# Altium project LM-008.PrjPcb
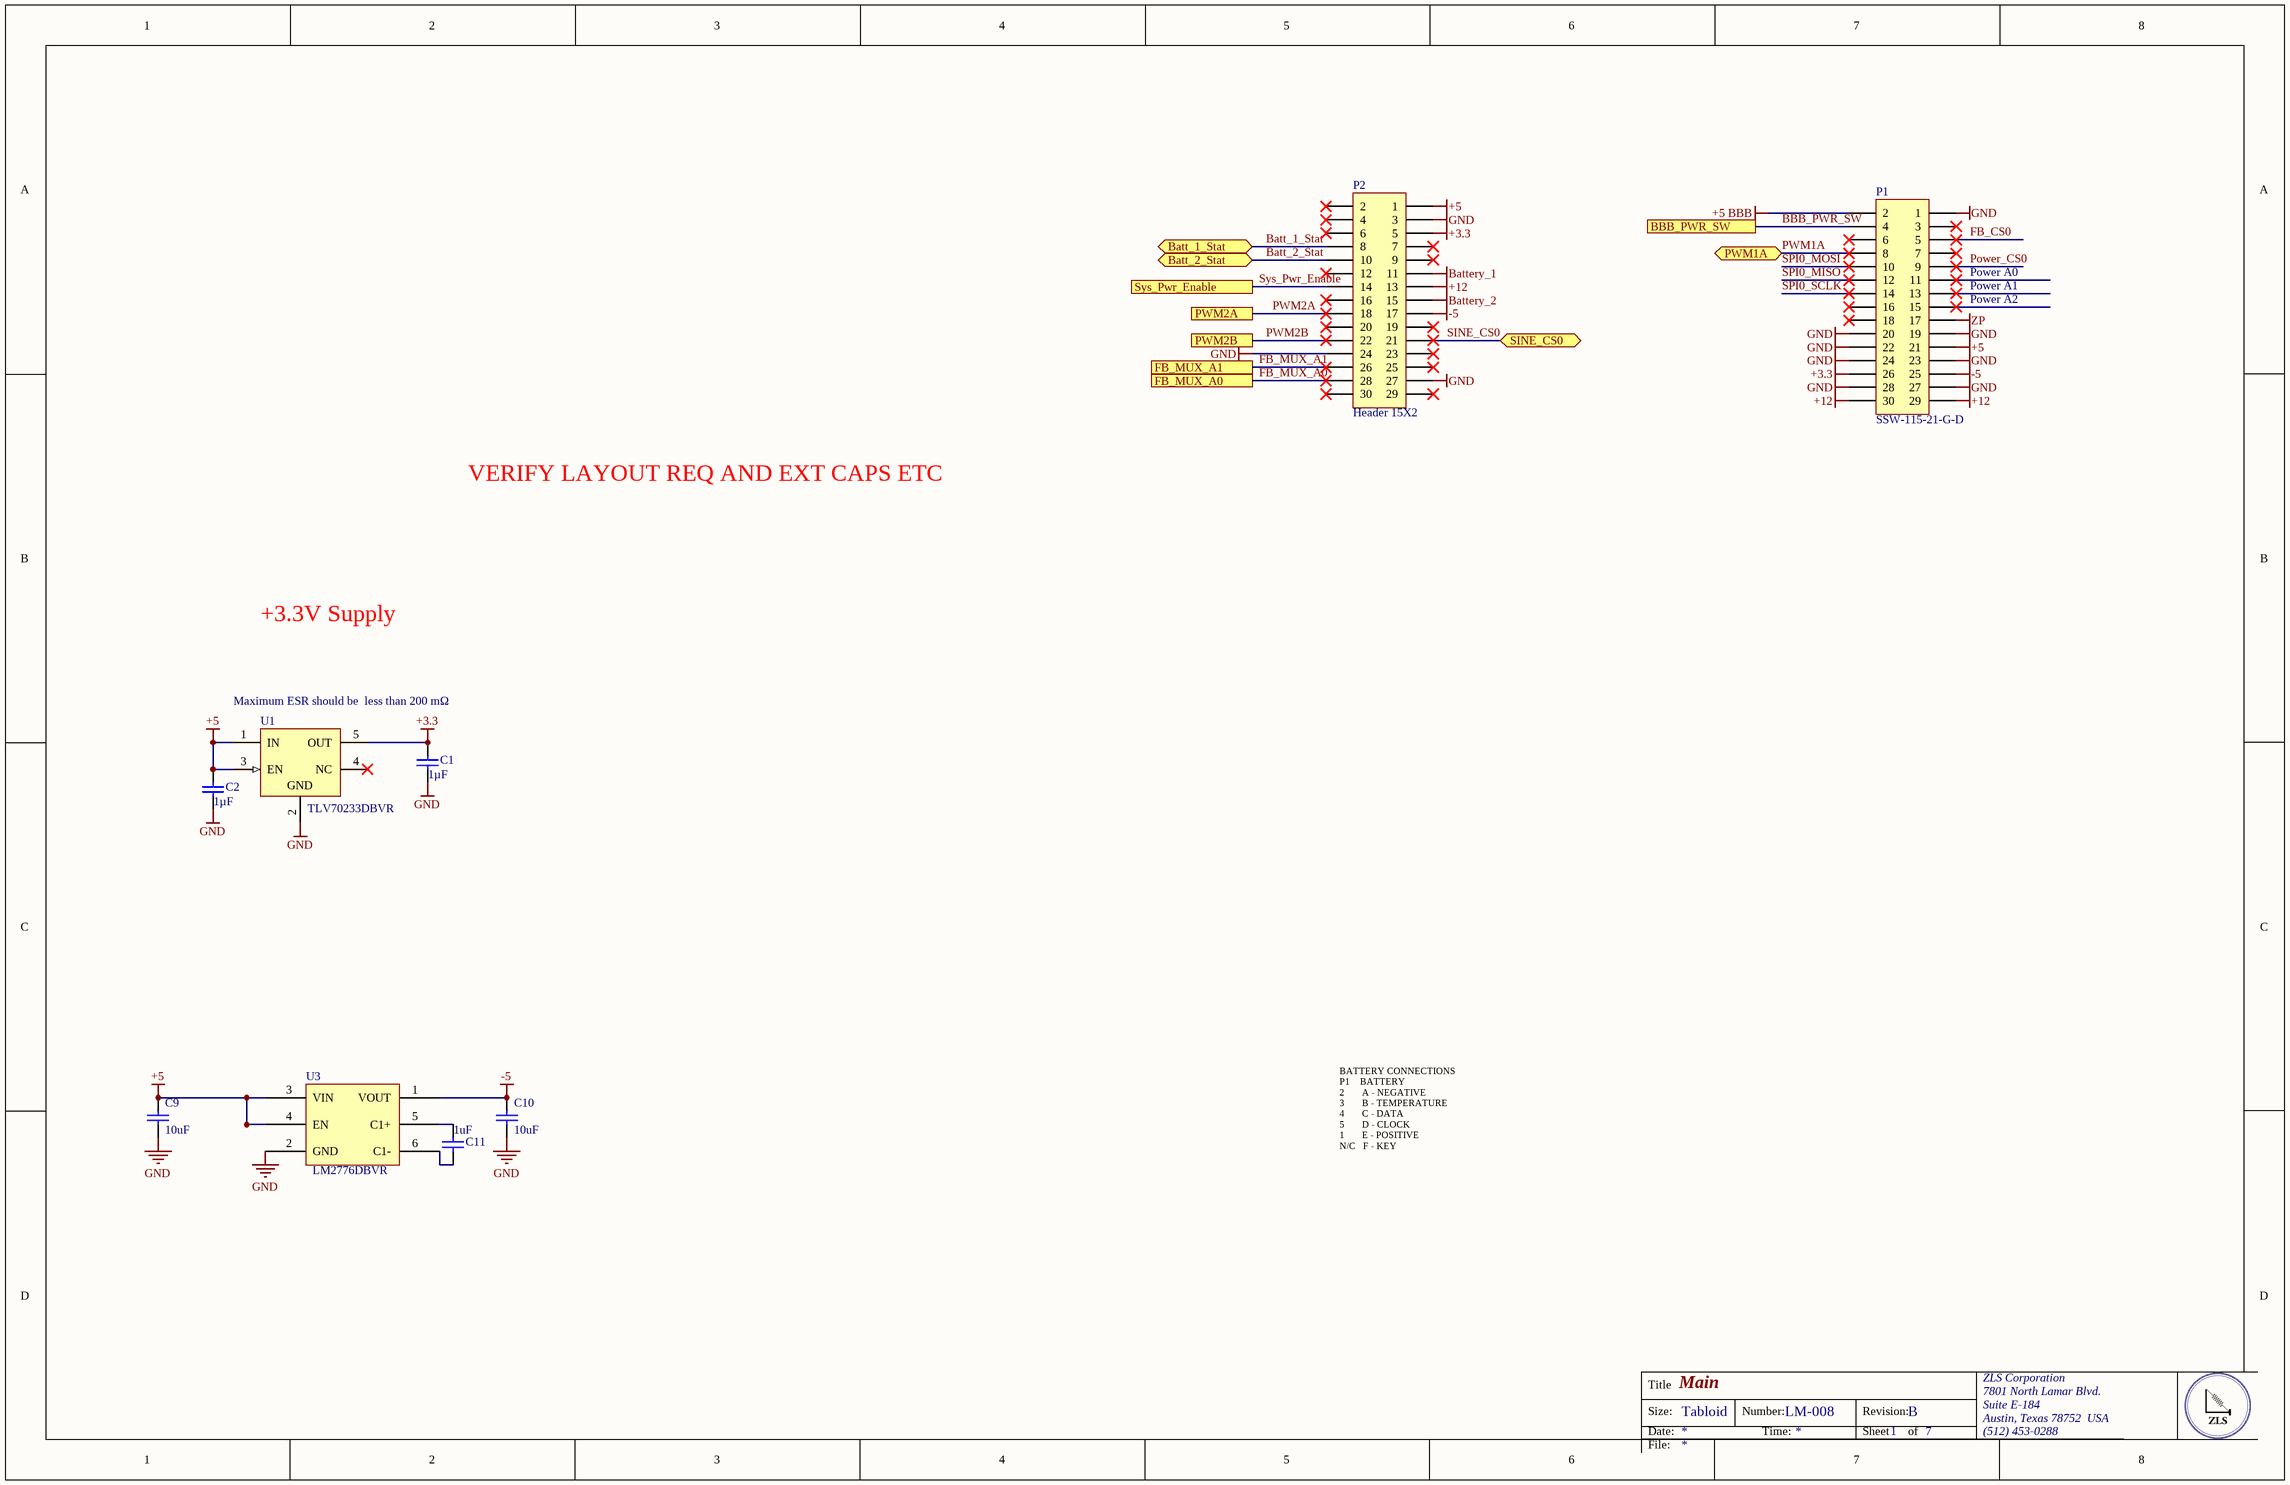
[diagram p0: LM-008.SchDoc]
5 sheets, 53 parts. Net scope: flat (ports and power ports of the same name join across sheets).
Board file: LM-008.PcbDoc
Sheets:
  LM-008.SchDoc
  12_Supply.SchDoc
  Force_Plate_Power_Supply.SchDoc
  BBB-Supply.SchDoc
  36V_HV_Supply.SchDoc

## Sheet LM-008.SchDoc: Main
size Tabloid; DocumentNumber: LM-008; Revision: B; SheetNumber: 1; SheetTotal: 7; DocumentName: LM-008

### Parts
C1  Capacitance: 1µF  [CAPC1206(3216)130_N]  (hidden comment: CAP CER 1UF 50V X7R 1210)
C2  Capacitance: 1µF  [CAPC1206(3216)130_N]  (hidden comment: CAP CER 1UF 50V X7R 1210)
C9  10uF  [CAPC0805(2012)145_N]
C10  10uF  [CAPC0805(2012)145_N]
C11  1uF  [CAPC0805(2012)145_N]
P1  SSW-115-21-G-D  [HDR2X15]
P2  Header 15X2  [HDR2X15]
U1  TLV70233DBVR  [DBV0005A_N]
U3  LM2776DBVR  [LM2776DBVR]

### Ports
Batt_1_Stat, Batt_2_Stat, BBB_PWR_SW, FB_MUX_A0, FB_MUX_A1, PWM1A, PWM2A, PWM2B, SINE_CS0, Sys_Pwr_Enable

### Nets
+3.3: C1.2 P1.26 P2.5 U1.5(OUT)
+5: C2.2 C9.1 P1.21 P2.1 U1.1(IN) U1.3(EN) U3.3(VIN) U3.4(EN)
+5 BBB: P1.2
+12: P1.29 P1.30 P2.13
-5: C10.1 P1.25 P2.17 U3.1(VOUT)
Battery_1: P2.11
Battery_2: P2.15
GND: C1.1 C2.1 C9.2 C10.2 P1.1 P1.19 P1.20 P1.22 P1.23 P1.24 P1.27 P1.28 P2.3 P2.24 P2.27 U1.2(GND) U3.2(GND)
ZP: P1.17
Batt_1_Stat: P2.8 ; port Batt_1_Stat
Batt_2_Stat: P2.10 ; port Batt_2_Stat
BBB_PWR_SW: P1.4 ; port BBB_PWR_SW
FB_CS0: P1.5
FB_MUX_A0: P2.28 ; port FB_MUX_A0
FB_MUX_A1: P2.26 ; port FB_MUX_A1
Power_CS0: P1.9
PWM1A: P1.8 ; port PWM1A
PWM2A: P2.18 ; port PWM2A
PWM2B: P2.22 ; port PWM2B
SINE_CS0: P2.21 ; port SINE_CS0
SPI0_MISO: P1.12
SPI0_MOSI: P1.10
SPI0_SCLK: P1.14
Sys_Pwr_Enable: P2.14 ; port Sys_Pwr_Enable
NetC11_1: C11.1 U3.5(C1+)
NetC11_2: C11.2 U3.6(C1-)

Not connected (* = marked no-connect by the designer): P1 3* 6* 7* 11* 13* 15* 16* 18*; P2 2* 4* 6* 7* 9* 12* 16* 19* 20* 23* 25* 29* 30*; U1 4(NC)*

### Notes on the sheet
- (near P1) Power A0
- (near P1) Power A1
- (near P1) Power A2
- VERIFY LAYOUT REQ AND EXT CAPS ETC
- +3.3V Supply
- Maximum ESR should be  less than 200 mΩ
- BATTERY CONNECTIONS
  P1    BATTERY
  2       A - NEGATIVE
  3       B - TEMPERATURE
  4       C - DATA
  5       D - CLOCK
  1       E - POSITIVE
  N/C   F - KEY
- Title
- Size:
- Date:
- Tabloid
- Number:
- Time:
- Revision:
- Sheet
- of
- ZLS Corporation
- 7801 North Lamar Blvd.
- Suite E-184
- Austin, Texas 78752  USA
- (512) 453-0288
- File:

### Library data of the parts
C1 C2 = CMP-1037-04913-1: Manufacturer: Murata Electronics North America; Manufacturer Part Number: GRM32RR71H105KA01L; Tolerance: ±10%; Supplier 1: Digi-Key; Supplier Part Number 1: 490-1863-6-ND; RoHS: RoHS Compliant; Category: Capacitors; Stock 1: 66890; Pricing 1: 1=0.35, 10=0.242, 100=0.1449, 500=0.10868 (USD); Packaging: Digi-Reel®; Part Status: Active; Voltage - Rated: 50V; Temperature Coefficient: X7R; Operating Temperature: -55°C ~ 125°C; Features: -; Ratings: -; Applications: General Purpose; Mounting Type: Surface Mount, MLCC; Package / Case: 1210 (3225 Metric); Size / Dimension: 0.126" L x 0.098" W (3.20mm x 2.50mm); Height - Seated (Max): -; Thickness (Max): 0.079" (2.00mm); Lead Spacing: -; Lead Style: -; ComponentLink1URL: http://search.murata.co.jp/Ceramy/image/img/A01X/G101/ENG/GRM32RR71H105KA01-01.pdf; ComponentLink1Description: http://search.murata.co.jp/Ceramy/image/img/A01X/G101/ENG/GRM32RR71H105KA01-01.pdf
C9 C10 = CMP-1036-04795-1: CAP CER 10UF 16V X6S 0805; Manufacturer: TDK Corporation; Manufacturer Part Number: C2012X6S1C106K085AC; Tolerance: ±10%; Notification: Current market demand for these product types have resulted in fluctuating and extending lead times. Lead times may differ.; Supplier 1: Digi-Key; Supplier Part Number 1: 445-14483-6-ND; RoHS: RoHS Compliant; Category: Capacitors; Stock 1: 0; Pricing 1: 1=0.38, 10=0.259, 100=0.1466, 500=0.1035, 1000=0.09056 (USD); Packaging: Digi-Reel®; Part Status: Active; Voltage - Rated: 16V; Temperature Coefficient: X6S; Operating Temperature: -55°C ~ 105°C; Features: Low ESL; Ratings: -; Applications: General Purpose; Failure Rate: -; Mounting Type: Surface Mount, MLCC; Package / Case: 0805 (2012 Metric); Size / Dimension: 0.079" L x 0.049" W (2.00mm x 1.25mm); Height - Seated (Max): -; Thickness (Max): 0.039" (1.00mm); Lead Spacing: -; Lead Style: -; ComponentLink1URL: https://product.tdk.com/info/en/catalog/datasheets/mlcc_commercial_general_en.pdf; ComponentLink1Description: https://product.tdk.com/info/en/catalog/datasheets/mlcc_commercial_general_en.pdf
C11 = CMP-1036-04795-1: CAP CER 1UF 25V X7R 0805; Manufacturer: Yageo; Manufacturer Part Number: CC0805KKX7R6BB105; Tolerance: ±10%; Voltage - Rated: 10V; Notification: Current market demand for these product types have resulted in fluctuating and extending lead times. Lead times may differ.; Supplier 1: Digi-Key; Supplier Part Number 1: 311-1458-6-ND; RoHS: RoHS Compliant; Category: Capacitors; Stock 1: 30000; Pricing 1: 1=0.25, 10=0.168, 100=0.0852, 500=0.0583, 1000=0.05158 (USD); Packaging: Digi-Reel®; Part Status: Active; Temperature Coefficient: X7R; Operating Temperature: -55°C ~ 125°C; Features: -; Ratings: -; Applications: General Purpose; Failure Rate: -; Mounting Type: Surface Mount, MLCC; Package / Case: 0805 (2012 Metric); Size / Dimension: 0.079" L x 0.049" W (2.00mm x 1.25mm); Height - Seated (Max): -; Thickness (Max): 0.057" (1.45mm); Lead Spacing: -; Lead Style: -; ComponentLink1URL: http://www.yageo.com/documents/recent/UPY-GPHC_X7R_6.3V-to-50V_18.pdf; ComponentLink1Description: http://www.yageo.com/documents/recent/UPY-GPHC_X7R_6.3V-to-50V_18.pdf
P1 = Header 15X2: Header, 15-Pin, Dual row; Manufacturer: Samtec Inc.; Connector Type: Receptacle; Style: Board to Board or Cable; Number of Positions: 30; Number of Positions Loaded: All; Pitch - Mating: 0.100" (2.54mm); Contact Length - Post: 0.104" (2.64mm); Material Flammability Rating: UL94 V-0; Current Rating: 5.7A per Contact; Supplier 1: Digi-Key; Supplier Part Number 1: SSW-115-21-G-D-ND; Manufacturer Part Number: SSW-115-21-G-D; RoHS: RoHS Compliant; Category: Connectors, Interconnects; Stock 1: 0; Pricing 1: 1=4.78 (USD); Packaging: Bulk; Part Status: Active; Contact Type: Forked; Row Spacing - Mating: 0.100" (2.54mm); Mounting Type: Through Hole; Termination: Solder; Fastening Type: Push-Pull; Contact Finish - Mating: Gold; Contact Finish Thickness - Mating: 20.0µin (0.51µm); Insulation Color: Black; Insulation Height: 0.335" (8.51mm); Operating Temperature: -55°C ~ 125°C; Contact Finish - Post: Gold; Mated Stacking Heights: -; Ingress Protection: -; Features: -; Voltage Rating: -; Applications: -; Insulation Material: Liquid Crystal Polymer (LCP); Contact Shape: Square; Contact Material: Phosphor Bronze; Contact Finish Thickness - Post: 3.00µin (0.076µm)
P2 = Header 15X2: Header, 15-Pin, Dual row; LatestRevisionDate: 17-Jul-2002; LatestRevisionNote: Re-released for DXP Platform.; Publisher: Altium Limited
U1 = CMP-0394-00528-2: Single Output LDO, 300 mA, Fixed 3.3 V Output, 2 to 5.5 V Input, with Low IQ, 5-pin SOT-23 (DBV), -40 to 125 degC, Green (RoHS & no Sb/Br); Manufacturer: Texas Instruments; Vout Adj(Max)(V): 3.3; Vin(Max)(V): 5.5; SubFamily: Single Channel LDO; Iq(Typ)(mA): 0.03; Iout(Max)(A): 0.3; Vin(Min)(V): 2; Vdo(Typ)(mV): 220; Vout Adj(Min)(V): 3.3; Eco-Plan: Green (RoHS & no Sb/Br); PackageVersion: 4073253-4/K; ComponentLink1Description: Manufacturer URL; DatasheetVersion: SLVSAG6B; ComponentLink2Description: Datasheet; ComponentLink3URL: http://www.ti.com/litv/pdf/mpds018i; ComponentLink2URL: http://www.ti.com/general/docs/lit/getliterature.tsp?genericPartNumber=TLV70233&fileType=pdf; PackageReference: DBV0005A; ComponentLink1URL: http://www.ti.com/; Mounting Technology: Surface Mount; ComponentLink3Description: Package Specification; PackageDescription: 5-Pin Plastic Small Outline, Body 1.60 Ãƒâ€” 2.90 mm, Pitch 0.95 mm; Code_JEDEC: MO-178; Fixed Output Options(V): 3.3; PartNumber: TLV70233DBVR; Accuracy(%): 2
U3 = LM2776DBVR: IC REG SWTCHD CAP INV 6SOT23; Manufacturer: Texas Instruments; Function: Ratiometric; Output Configuration: Negative; Topology: Charge Pump; Output Type: Fixed; Number of Outputs: 1; Voltage - Input (Min): 2.7V; Voltage - Input (Max): 5.5V; Voltage - Output (Min/Fixed): -Vin; Current - Output: 200mA; Frequency - Switching: 2MHz; Synchronous Rectifier: No; Supplier 1: Digi-Key; Supplier Part Number 1: 296-43957-6-ND; Manufacturer Part Number: LM2776DBVR; RoHS: RoHS Compliant; Category: Integrated Circuits (ICs); Stock 1: 13045; Pricing 1: 1=1.05, 10=0.936, 100=0.7297, 500=0.60276, 1000=0.47586 (USD); Packaging: Digi-Reel®; Part Status: Active; Voltage - Output (Max): -; Operating Temperature: -40°C ~ 85°C (TA); Mounting Type: Surface Mount; Package / Case: SOT-23-6; Supplier Device Package: SOT-23-6; ComponentLink1URL: http://www.ti.com/lit/ds/symlink/lm2776.pdf; ComponentLink1Description: http://www.ti.com/lit/ds/symlink/lm2776.pdf

## Sheet 12_Supply.SchDoc: 12V Supply
size Tabloid; DocumentNumber: LM-008; Revision: B; SheetNumber: 4; SheetTotal: 7
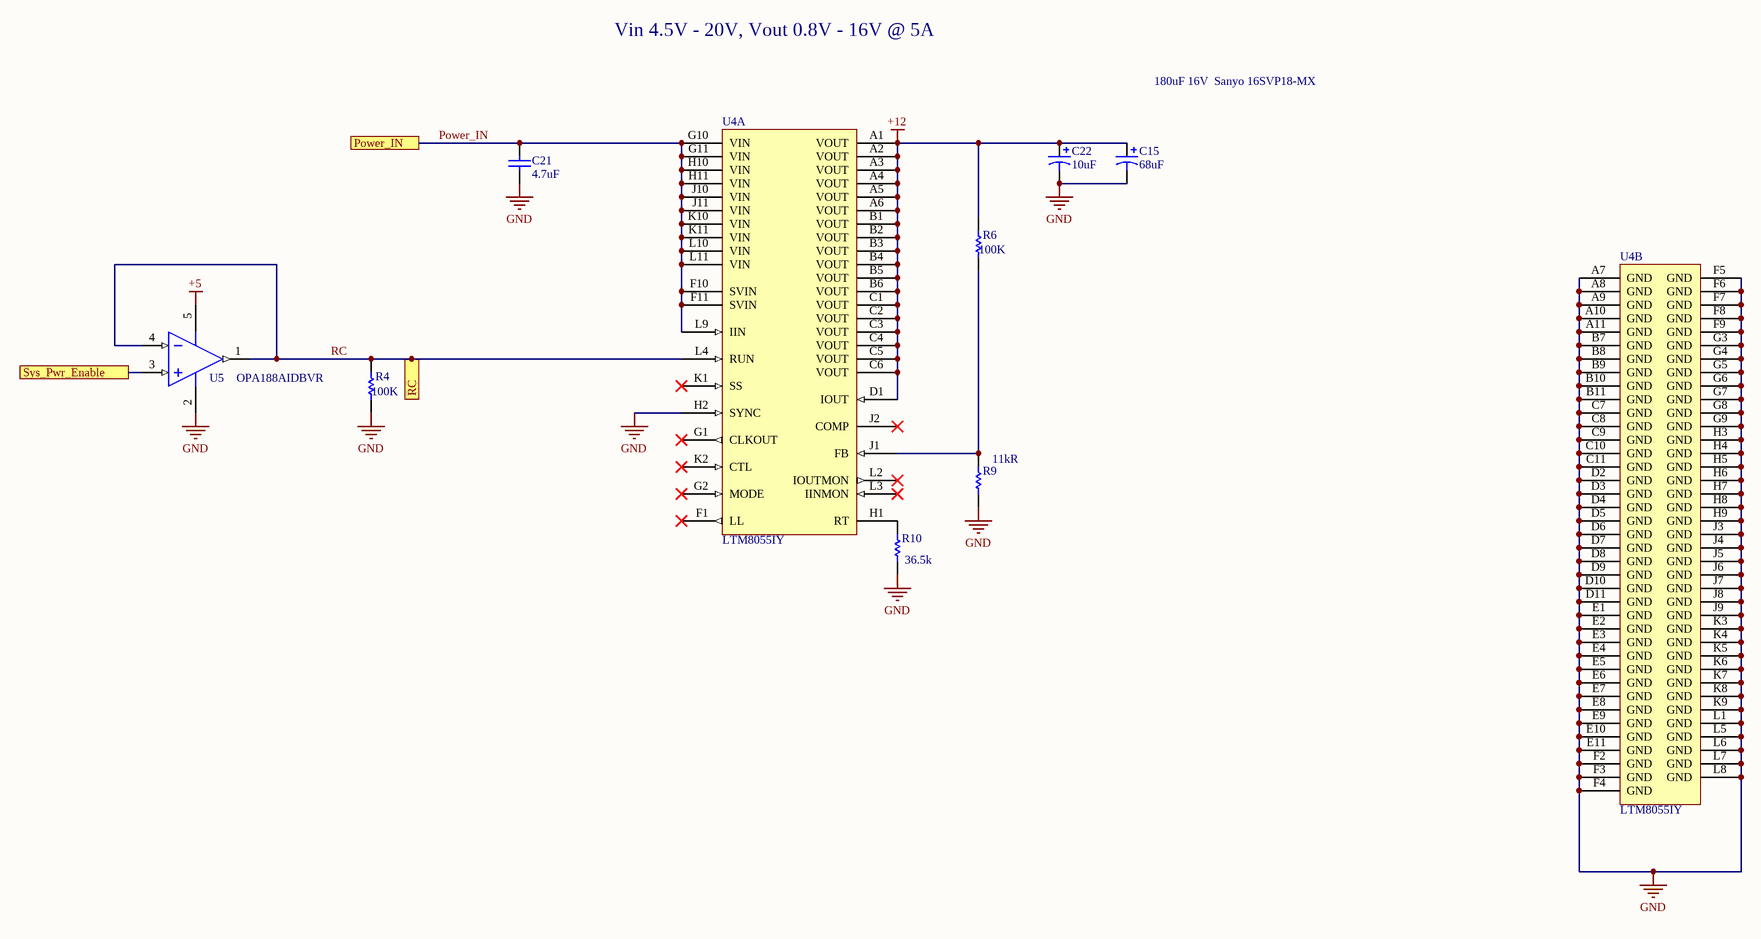
[diagram p1: 12_Supply.SchDoc]

### Parts
C15  68uF  [AVX-CAPC7343_V]
C21  4.7uF  [CAPC1210(3225)100_M]
C22  10uF  [C0805]
R4  Resistance: 100K  [RESC0805(2012)_M]  (hidden comment: RES SMD 100K OHM 1% 1/8W 0805)
R6  Resistance: 100K  [RESC0805(2012)_M]  (hidden comment: RES SMD 100K OHM 1% 1/8W 0805)
R9  Resistance: 11kR  [RESC0805(2012)_M]  (hidden comment: RES SMD 11K OHM 1% 1/8W 0805)
R10  Resistance: 36.5k  [RESC0805(2012)_M]  (hidden comment: RES SMD 35K OHM 1% 1/8W 0805)
U4  LTM8055IY  [LT-BGA-121-15000X15000X4920]  (parts A,B of 2)
U5  OPA188AIDBVR  [DBV0005A_M]

### Ports
Power_IN, RC, Sys_Pwr_Enable

### Nets
+5: U5.5(V+)
+12: C15.1 C22.1 R6.1 U4.A1(VOUT) U4.A2(VOUT) U4.A3(VOUT) U4.A4(VOUT) U4.A5(VOUT) U4.A6(VOUT) U4.B1(VOUT) U4.B2(VOUT) U4.B3(VOUT) U4.B4(VOUT) U4.B5(VOUT) U4.B6(VOUT) U4.C1(VOUT) U4.C2(VOUT) U4.C3(VOUT) U4.C4(VOUT) U4.C5(VOUT) U4.C6(VOUT) U4.D1(IOUT)
GND: C15.2 C21.1 C22.2 R4.2 R9.2 R10.2 U4.A7(GND) U4.A8(GND) U4.A9(GND) U4.A10(GND) U4.A11(GND) U4.B7(GND) U4.B8(GND) U4.B9(GND) U4.B10(GND) U4.B11(GND) U4.C7(GND) U4.C8(GND) U4.C9(GND) U4.C10(GND) U4.C11(GND) U4.D2(GND) U4.D3(GND) U4.D4(GND) U4.D5(GND) U4.D6(GND) U4.D7(GND) U4.D8(GND) U4.D9(GND) U4.D10(GND) U4.D11(GND) U4.E1(GND) U4.E2(GND) U4.E3(GND) U4.E4(GND) U4.E5(GND) U4.E6(GND) U4.E7(GND) U4.E8(GND) U4.E9(GND) U4.E10(GND) U4.E11(GND) U4.F2(GND) U4.F3(GND) U4.F4(GND) U4.F5(GND) U4.F6(GND) U4.F7(GND) U4.F8(GND) U4.F9(GND) U4.G3(GND) U4.G4(GND) U4.G5(GND) U4.G6(GND) U4.G7(GND) U4.G8(GND) U4.G9(GND) U4.H2(SYNC) U4.H3(GND) U4.H4(GND) U4.H5(GND) U4.H6(GND) U4.H7(GND) U4.H8(GND) U4.H9(GND) U4.J3(GND) U4.J4(GND) U4.J5(GND) U4.J6(GND) U4.J7(GND) U4.J8(GND) U4.J9(GND) U4.K3(GND) U4.K4(GND) U4.K5(GND) U4.K6(GND) U4.K7(GND) U4.K8(GND) U4.K9(GND) U4.L1(GND) U4.L5(GND) U4.L6(GND) U4.L7(GND) U4.L8(GND) U5.2(V-)
Power_IN: C21.2 U4.F10(SVIN) U4.F11(SVIN) U4.G10(VIN) U4.G11(VIN) U4.H10(VIN) U4.H11(VIN) U4.J10(VIN) U4.J11(VIN) U4.K10(VIN) U4.K11(VIN) U4.L9(IIN) U4.L10(VIN) U4.L11(VIN) ; port Power_IN
RC: R4.1 U4.L4(RUN) U5.1(OUT) U5.4(IN-) ; port RC
Sys_Pwr_Enable: U5.3(IN+) ; port Sys_Pwr_Enable
NetR6_2: R6.2 R9.1 U4.J1(FB)
NetR10_1: R10.1 U4.H1(RT)

Not connected (* = marked no-connect by the designer): U4 F1(LL)* G1(CLKOUT)* G2(MODE)* J2(COMP)* K1(SS)* K2(CTL)* L2(IOUTMON)* L3(IINMON)*

### Notes on the sheet
- Vin 4.5V - 20V, Vout 0.8V - 16V @ 5A
- 180uF 16V  Sanyo 16SVP18-MX
- Title
- Size:
- Date:
- Tabloid
- Number:
- Time:
- Revision:
- Sheet
- of
- ZLS Corporation
- 7801 North Lamar Blvd.
- Suite E-184
- Austin, Texas 78752  USA
- (512) 453-0288
- File:

### Library data of the parts
C15 = CMP-0279-00002-2: CAP TANT POLY 68UF 25V 2917; Manufacturer: Kyocera AVX; Manufacturer Part Number: TCJE686M025R0050; Tolerance: 20%; ESR (Equivalent Series Resistance): 50mR; Leakage Current: 170uA; Life (Hours): 2000Hour; Dissipation Factor: 6%; ComponentLink2Description: Datasheet; ComponentLink2URL: http://www.avx.com/docs/Catalogs/taj.pdf; ComponentLink1URL: http://www.avx.com/; ComponentLink1Description: Manufacturer URL; Supplier 1: Digi-Key; Supplier Part Number 1: 478-9471-6-ND; Stock 1: 439; Pricing 1: 1=3.92, 10=3.163, 100=2.4672 (USD); Mount: Surface Mount; Case/Package: 2917; Case Code (Imperial): 2917; Case Code (Metric): 7343; Min Operating Temperature: -55°C; Max Operating Temperature: 105°C; Capacitance: 68uF; Voltage Rating: 25V; Packaging: Tape and Reel; Package Quantity: 400; Voltage Rating (DC): 25V; Termination: SMD/SMT; Features: General Purpose; Length: 7.3mm; Height: 4.3mm; Width: 0.169inch; Height - Seated (Max): 0.169inch; Depth: 4.3mm; Radiation Hardening: No; ComponentLink3URL: http://www.avx.com/docs/catalogs/tcj.pdf?src-supplier=Avnet; ComponentLink3Description: http://www.avx.com/docs/catalogs/tcj.pdf?src-supplier=Avnet
C21 = CMP-1038-00619-1: CAP CER 4.7UF 50V X7R 1210; Manufacturer: Murata; Manufacturer Part Number: GCM32ER71H475KA55K; Tolerance: 10%; Supplier 1: Digi-Key; Supplier Part Number 1: 490-8066-6-ND; Stock 1: 63504; Pricing 1: 1=1.8, 10=1.424, 100=1.0676, 500=0.80666, 1000=0.71177 (USD); Mount: Surface Mount; Case/Package: 1210; Case Code (Metric): 3225; Case Code (Imperial): 1210; Min Operating Temperature: -55°C; Max Operating Temperature: 125°C; Capacitance: 4.7uF; Packaging: Tape and Reel; Package Quantity: 1; Voltage Rating: 50V; Voltage Rating (DC): 50V; Dielectric: X7R; Termination: SMD/SMT; Length: 3.2mm; Height: 2.5mm; Width: 0.098inch; Thickness: 0.106inch; Depth: 2.5mm; Ratings: AEC-Q200; Radiation Hardening: No; ComponentLink1URL: http://search.murata.co.jp/Ceramy/image/img/A01X/partnumbering_e_02.pdf?src-supplier=Digi-Key; ComponentLink1Description: http://search.murata.co.jp/Ceramy/image/img/A01X/partnumbering_e_02.pdf?src-supplier=Digi-Key; ComponentLink2URL: http://psearch.en.murata.com/capacitor/product/GCM32ER71H475KA55%23.pdf?src-supplier=Digi-Key; ComponentLink2Description: http://psearch.en.murata.com/capacitor/product/GCM32ER71H475KA55%23.pdf?src-supplier=Digi-Key; ComponentLink3URL: http://psearch.murata.com/capacitor/product/GCM32ER71H475KA55%23.pdf?src-supplier=Avnet; ComponentLink3Description: http://psearch.murata.com/capacitor/product/GCM32ER71H475KA55%23.pdf?src-supplier=Avnet
C22 = Cap Pol3: Polarized Capacitor (Surface Mount)
R4 R6 = CMP-1013-00017-1: Manufacturer: Vishay; Manufacturer Part Number: CRCW0805100KFKEA; Temperature Coefficient: 100ppm/°C; Power Rating: 125mW; Voltage Rating: 150V; Supplier 1: Avnet; Supplier Part Number 1: CRCW0805100KFKEA/BKN; Stock 1: 1317; Pricing 1: 1=0.1, 10=0.049, 25=0.042, 50=0.035, 100=0.028 (USD); Mount: Surface Mount; Case/Package: 0805; Number of Pins: 2; Weight: 0.000194oz; Contact Plating: Tin; Case Code (Imperial): 0805; Case Code (Metric): 2012; Min Operating Temperature: -55°C; Max Operating Temperature: 155°C; Tolerance: 1%; Composition: Thick Film; Termination: SMD/SMT; Packaging: Tape and Reel; Package Quantity: 5000; Military Standard: Not; Voltage Rating (DC): 150V; Length: 2mm; Height: 0.45mm; Width: 1.25mm; Depth: 1.25mm; Radiation Hardening: No; Lead Free: Lead Free; REACH SVHC: Unknown; ComponentLink1URL: https://datasheet.ciiva.com/11809/0900766b80d98b26-11809057.pdf; ComponentLink1Description: https://datasheet.ciiva.com/11809/0900766b80d98b26-11809057.pdf; ComponentLink2URL: https://datasheet.ciiva.com/7777/1697337-7777349.pdf; ComponentLink2Description: https://datasheet.ciiva.com/7777/1697337-7777349.pdf; ComponentLink3URL: https://datasheet.ciiva.com/3258/dcrcwe3-3258006.pdf; ComponentLink3Description: https://datasheet.ciiva.com/3258/dcrcwe3-3258006.pdf; ComponentLink4URL: https://datasheet.ciiva.com/16754/70201119-16754822.pdf; ComponentLink4Description: https://datasheet.ciiva.com/16754/70201119-16754822.pdf; ComponentLink5URL: https://datasheet.ciiva.com/8337/dcrcwe3-8337738.pdf; ComponentLink5Description: https://datasheet.ciiva.com/8337/dcrcwe3-8337738.pdf; ComponentLink6URL: https://datasheet.ciiva.com/16341/dcrcwe3-16341530.pdf; ComponentLink6Description: https://datasheet.ciiva.com/16341/dcrcwe3-16341530.pdf; ComponentLink7URL: https://datasheet.ciiva.com/16852/dcrcwe3-16852810.pdf; ComponentLink7Description: https://datasheet.ciiva.com/16852/dcrcwe3-16852810.pdf; ComponentLink8URL: https://datasheet.ciiva.com/16720/70201119-16720891.pdf; ComponentLink8Description: https://datasheet.ciiva.com/16720/70201119-16720891.pdf; ComponentLink9URL: https://datasheet.ciiva.com/7777/1720486-7777565.pdf; ComponentLink9Description: https://datasheet.ciiva.com/7777/1720486-7777565.pdf
R9 = CMP-1013-00017-1: Manufacturer: TE Connectivity Holsworthy; Manufacturer Part Number: CRG0805F11K; Temperature Coefficient: 100ppm/°C; Power Rating: 125mW; Voltage Rating: 150V; Number of Resistors: 1; ComponentLink1URL: https://datasheet.ciiva.com/11809/0900766b80d98b26-11809057.pdf; ComponentLink1Description: https://datasheet.ciiva.com/11809/0900766b80d98b26-11809057.pdf; ComponentLink2URL: https://datasheet.ciiva.com/7777/1697337-7777349.pdf; ComponentLink2Description: https://datasheet.ciiva.com/7777/1697337-7777349.pdf; ComponentLink3URL: https://datasheet.ciiva.com/3258/dcrcwe3-3258006.pdf; ComponentLink3Description: https://datasheet.ciiva.com/3258/dcrcwe3-3258006.pdf; ComponentLink4URL: https://datasheet.ciiva.com/16754/70201119-16754822.pdf; ComponentLink4Description: https://datasheet.ciiva.com/16754/70201119-16754822.pdf; ComponentLink5URL: https://datasheet.ciiva.com/8337/dcrcwe3-8337738.pdf; ComponentLink5Description: https://datasheet.ciiva.com/8337/dcrcwe3-8337738.pdf; ComponentLink6URL: https://datasheet.ciiva.com/16341/dcrcwe3-16341530.pdf; ComponentLink6Description: https://datasheet.ciiva.com/16341/dcrcwe3-16341530.pdf; ComponentLink7URL: https://datasheet.ciiva.com/16852/dcrcwe3-16852810.pdf; ComponentLink7Description: https://datasheet.ciiva.com/16852/dcrcwe3-16852810.pdf; ComponentLink8URL: https://datasheet.ciiva.com/16720/70201119-16720891.pdf; ComponentLink8Description: https://datasheet.ciiva.com/16720/70201119-16720891.pdf; ComponentLink9URL: https://datasheet.ciiva.com/7777/1720486-7777565.pdf; ComponentLink9Description: https://datasheet.ciiva.com/7777/1720486-7777565.pdf; Supplier 1: Digikey; Supplier Part Number 1: A126334DKR-ND; Stock 1: 142510; Pricing 1: 1=0.1, 10=0.052, 100=0.021, 1000=0.00943, 2500=0.00819 (USD); Mount: Surface Mount; Case/Package: 0805; Weight: 0.000194oz; Case Code (Imperial): 0805; Case Code (Metric): 2012; Min Operating Temperature: -55°C; Max Operating Temperature: 125°C; Tolerance: 1%; Packaging: Tape and Reel; Composition: Thick Film; Package Quantity: 5000; Number of Terminations: 2; Termination: Solder; Length: 2mm; Height: 0.55mm; Width: 1.25mm; ELV: Compliant; ComponentLink10URL: http://www.mouser.com/ds/2/418/NG_CD_1623104_BA-655654.pdf?src-supplier=Mouser; ComponentLink10Description: http://www.mouser.com/ds/2/418/NG_CD_1623104_BA-655654.pdf?src-supplier=Mouser
R10 = CMP-1013-00017-1: Manufacturer: Vishay; Manufacturer Part Number: CRCW080536K5FKEA; Temperature Coefficient: 100ppm/°C; Max Power Dissipation: 125mW; Voltage Rating: 150V; ComponentLink1URL: https://datasheet.ciiva.com/11809/0900766b80d98b26-11809057.pdf; ComponentLink1Description: https://datasheet.ciiva.com/11809/0900766b80d98b26-11809057.pdf; ComponentLink2URL: https://datasheet.ciiva.com/7777/1697337-7777349.pdf; ComponentLink2Description: https://datasheet.ciiva.com/7777/1697337-7777349.pdf; ComponentLink3URL: https://datasheet.ciiva.com/3258/dcrcwe3-3258006.pdf; ComponentLink3Description: https://datasheet.ciiva.com/3258/dcrcwe3-3258006.pdf; ComponentLink4URL: https://datasheet.ciiva.com/16754/70201119-16754822.pdf; ComponentLink4Description: https://datasheet.ciiva.com/16754/70201119-16754822.pdf; ComponentLink5URL: https://datasheet.ciiva.com/8337/dcrcwe3-8337738.pdf; ComponentLink5Description: https://datasheet.ciiva.com/8337/dcrcwe3-8337738.pdf; ComponentLink6URL: https://datasheet.ciiva.com/16341/dcrcwe3-16341530.pdf; ComponentLink6Description: https://datasheet.ciiva.com/16341/dcrcwe3-16341530.pdf; ComponentLink7URL: https://datasheet.ciiva.com/16852/dcrcwe3-16852810.pdf; ComponentLink7Description: https://datasheet.ciiva.com/16852/dcrcwe3-16852810.pdf; ComponentLink8URL: https://datasheet.ciiva.com/16720/70201119-16720891.pdf; ComponentLink8Description: https://datasheet.ciiva.com/16720/70201119-16720891.pdf; ComponentLink9URL: https://datasheet.ciiva.com/7777/1720486-7777565.pdf; ComponentLink9Description: https://datasheet.ciiva.com/7777/1720486-7777565.pdf; ComponentLink10URL: http://www.mouser.com/ds/2/418/NG_CD_1623104_BA-655654.pdf?src-supplier=Mouser; ComponentLink10Description: http://www.mouser.com/ds/2/418/NG_CD_1623104_BA-655654.pdf?src-supplier=Mouser; Supplier 1: Digi-Key; Supplier Part Number 1: 541-36.5KCDKR-ND; Stock 1: 56622; Pricing 1: 1=0.1, 10=0.069, 100=0.028, 1000=0.01256, 2500=0.0109 (USD); Case/Package: 0805; Number of Pins: 2; Weight: 0.000194oz; Contact Plating: Tin; Case Code (Imperial): 0805; Case Code (Metric): 2012; Min Operating Temperature: -55°C; Max Operating Temperature: 155°C; Tolerance: 1%; Composition: Thick Film; Packaging: Tape and Reel; Package Quantity: 10; Number of Terminations: 2; Features: Automotive AEC-Q200; Power Rating: 125mW; Military Standard: Not; Termination: SMD/SMT; Length: 2mm; Height: 0.45mm; Width: 1.25mm; Depth: 1.25mm; Radiation Hardening: No; REACH SVHC: Unknown; ComponentLink11URL: http://uk.rs-online.com/webdocs/0d98/0900766b80d98b26.pdf?src-supplier=RSComponents; ComponentLink11Description: http://uk.rs-online.com/webdocs/0d98/0900766b80d98b26.pdf?src-supplier=RSComponents; ComponentLink12URL: https://www.verical.com/server-webapp/html/getDatasheet?partID=32738&src-supplier=Verical; ComponentLink12Description: https://www.verical.com/server-webapp/html/getDatasheet?partID=32738&src-supplier=Verical; ComponentLink13URL: http://www.farnell.com/datasheets/1697337.pdf?src-supplier=Farnell; ComponentLink13Description: http://www.farnell.com/datasheets/1697337.pdf?src-supplier=Farnell; ComponentLink14URL: http://www.vishay.com/docs/20035/dcrcwe3.pdf?src-supplier=Avnet; ComponentLink14Description: http://www.vishay.com/docs/20035/dcrcwe3.pdf?src-supplier=Avnet; ComponentLink15URL: http://www.farnell.com/datasheets/2111203.pdf?src-supplier=Element14; ComponentLink15Description: http://www.farnell.com/datasheets/2111203.pdf?src-supplier=Element14; ComponentLink16URL: https://www.alliedelec.com/m/d/0c934d6939ccefa68dbe0b96d821c8cf.pdf?src-supplier=Allied+Electronics; ComponentLink16Description: https://www.alliedelec.com/m/d/0c934d6939ccefa68dbe0b96d821c8cf.pdf?src-supplier=Allied+Electronics; ComponentLink17URL: http://www.vishay.com/docs/20035/dcrcwe3.pdf?src-supplier=Digi-Key; ComponentLink17Description: http://www.vishay.com/docs/20035/dcrcwe3.pdf?src-supplier=Digi-Key; ComponentLink18URL: http://www.farnell.com/datasheets/2049244.pdf?src-supplier=Element14; ComponentLink18Description: http://www.farnell.com/datasheets/2049244.pdf?src-supplier=Element14; ComponentLink19URL: http://www.vishay.com/docs/20035/dcrcwe3.pdf?src-supplier=Avnet+Europe; ComponentLink19Description: http://www.vishay.com/docs/20035/dcrcwe3.pdf?src-supplier=Avnet+Europe
U4 = CMP-2000-06614-1: Buck-Boost uModule Regulator, 8.5 A, 5 to 36 V, -40 to 125 degC, 121-Ball BGA, RoHS, Tray; Manufacturer: LinearTechnology; Current - Output (Max): 8.5A; Number of Outputs: 1; Efficiency: 97.5%; Voltage - Input (Max): 36V; Package Version: Rev. A, 11/2012; Voltage - Output 1: 1.2~36V; Voltage - Input (Min): 5V; Operating Temperature: -40°C~125°C; Voltage - Output 3: -; Datasheet Version: Rev. A, 01/2016; Power (Watts) - Manufacture Series: -; Series: µModule®; Manufacturer URL: http://www.linear.com/; Datasheet URL: http://cds.linear.com/docs/en/datasheet/8055fa.pdf; Type: Non-IsolatedPoLModule; Voltage - Output 2: -; Mounting Type: SurfaceMount; Packaging: Tray; Mounting Technology: SurfaceMount; Package URL: http://www.linear.com/docs/41075; Features: OTP; Power (Watts) - Max: -; Package Reference: BGA-121; Category: PowerSupplies-BoardMount; Package / Case: 121-BGA; Voltage - Isolation: -; Package Description: 121-Ball BGA, Body 15 x 15 mm, Pitch 1.27 mm; Applications: ITE(Commercial); Family: DCDCConverters; PartId: 1
U5 = CMP-0809-00005-2: Precision, Low Noise, Rail-to-Rail Output, Zero-Drift Operational Amplifier, 4 to 36 V, -40 to 125 degC, 5-pin SOT23 (DBV5), Green (RoHS & no Sb/Br); Manufacturer: Texas Instruments; Slew Rate: 0.8 V/µs; Current - Supply: 450µA; Voltage - Supply, Single/Dual (±): 4 V ~ 36 V, ±2 V ~ 18 V; Supplier 1: Digi-Key; Supplier Part Number 1: 296-40438-1-ND; Manufacturer Part Number: OPA188AIDBVR; RoHS: RoHS Compliant; Category: Integrated Circuits (ICs); Stock 1: 1779; Pricing 1: 1=2.46, 10=2.211, 100=1.7771, 500=1.46002, 1000=1.20974 (USD); Packaging: Cut Tape (CT); Part Status: Active; Amplifier Type: Zero-Drift; Output Type: Rail-to-Rail; Operating Temperature: -40°C ~ 125°C; Mounting Type: Surface Mount; Package / Case: SC-74A, SOT-753; Supplier Device Package: SOT-23-5; ComponentLink1URL: http://www.ti.com/lit/ds/symlink/opa188.pdf; ComponentLink1Description: http://www.ti.com/lit/ds/symlink/opa188.pdf

## Sheet Force_Plate_Power_Supply.SchDoc: Power Input
size OrCAD A; DocumentNumber: LM-008; Revision: D
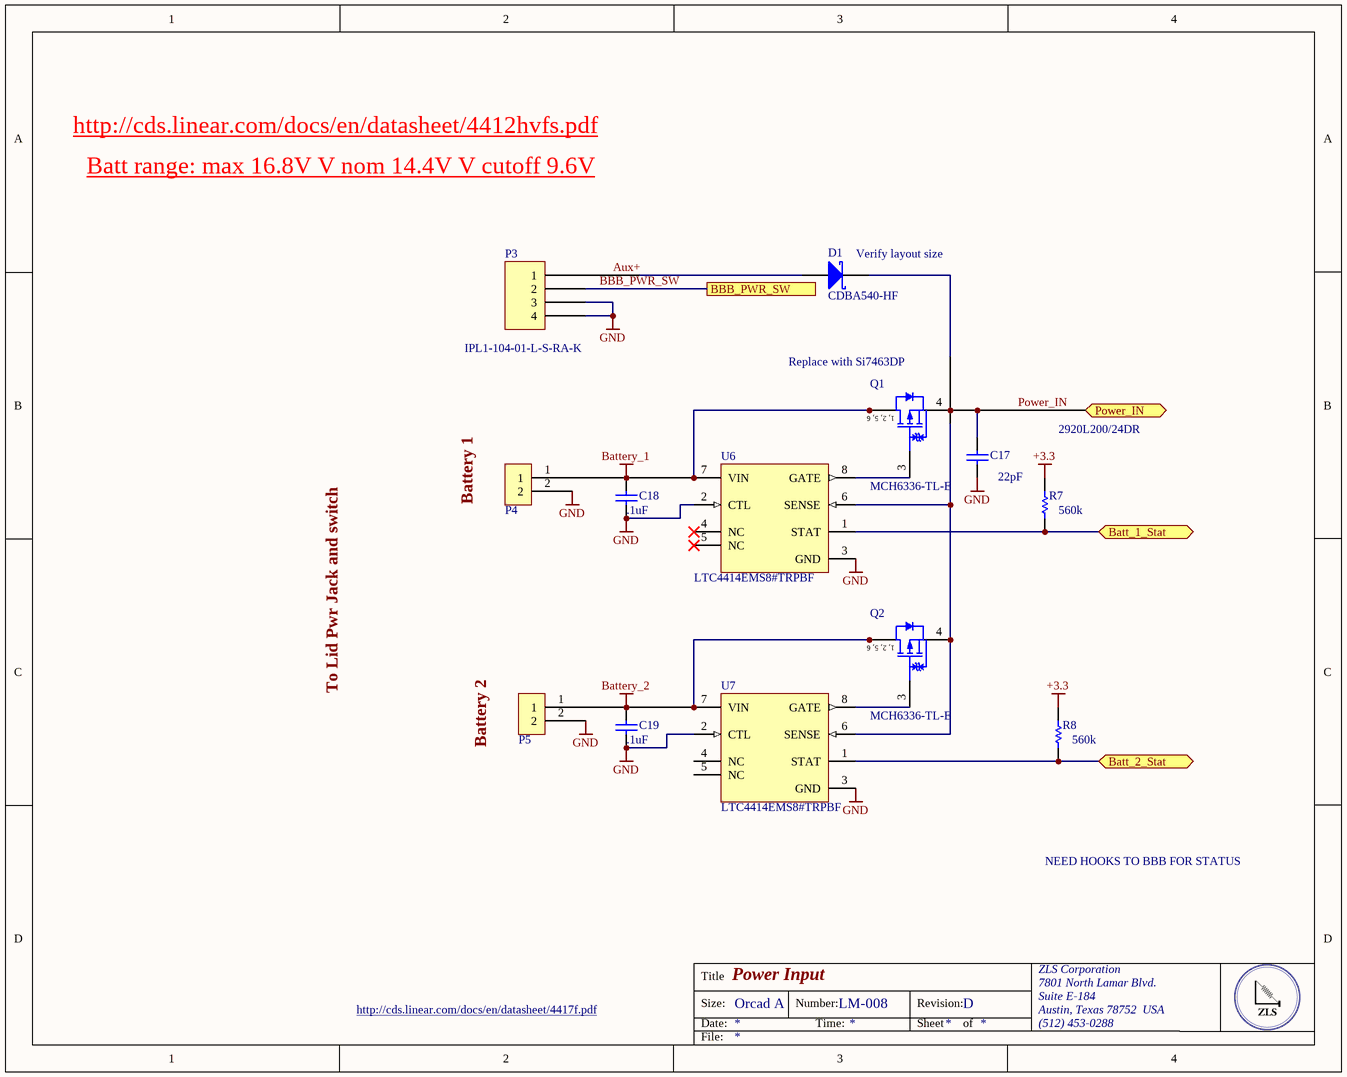
[diagram p2: Force_Plate_Power_Supply.SchDoc]

### Parts
C17  Capacitance: 22pF  [CAPC1206(3216)130_N]  (hidden comment: CAP CER 10UF 6.3V X5R 1206)
C18  Capacitance: .1uF  [CAPC1206(3216)130_N]  (hidden comment: CAP CER 10UF 6.3V X5R 1206)
C19  Capacitance: .1uF  [CAPC1206(3216)130_N]  (hidden comment: CAP CER 10UF 6.3V X5R 1206)
D1  CDBA540-HF  [VISH-DO-214AC-2_M]
P3  IPL1-104-01-L-S-RA-K  [IPL1-104-01-L-S-RA-K]
P4  IPL1-102-01-F-S-RA-K  [IPL1-102-01-F-S-RA-K]  (value not drawn)
P5  IPL1-102-01-F-S-RA-K  [IPL1-102-01-F-S-RA-K]  (value not drawn)
Q1  MCH6336-TL-E  [ONSC-MCPH-6_V]
Q2  MCH6336-TL-E  [ONSC-MCPH-6_V]
R7  560k  [RESC0402(1005)_L]
R8  560k  [RESC0402(1005)_L]
U6  LTC4414EMS8#TRPBF  [LT-MS8-8_L]
U7  LTC4414EMS8#TRPBF  [LT-MS8-8_L]

### Ports
Batt_1_Stat, Batt_2_Stat, BBB_PWR_SW, Power_IN

### Nets
+3.3: R7.2 R8.2
Battery_1: C18.2 P4.1 Q1.1(D) Q1.2(D) Q1.5(D) Q1.6(D) U6.7(VIN)
Battery_2: C19.2 P5.1 Q2.1(D) Q2.2(D) Q2.5(D) Q2.6(D) U7.7(VIN)
GND: C17.1 C18.1 C19.1 P3.3 P3.4 P4.2 P5.2 U6.2(CTL) U6.3(GND) U7.2(CTL) U7.3(GND)
Aux+: D1.1(A) P3.1
Batt_1_Stat: R7.1 U6.1(STAT) ; port Batt_1_Stat
Batt_2_Stat: R8.1 U7.1(STAT) ; port Batt_2_Stat
BBB_PWR_SW: P3.2 ; port BBB_PWR_SW
Power_IN: C17.2 D1.2(K) Q1.4(S) Q2.4(S) U6.6(SENSE) U7.6(SENSE) ; port Power_IN
NetQ1_3: Q1.3(G) U6.8(GATE)
NetQ2_3: Q2.3(G) U7.8(GATE)

Not connected (* = marked no-connect by the designer): U6 4(NC)* 5(NC)*; U7 4(NC) 5(NC)

### Notes on the sheet
- http://cds.linear.com/docs/en/datasheet/4412hvfs.pdf
- Batt range: max 16.8V V nom 14.4V V cutoff 9.6V
- (near D1) Verify layout size
- (near Q1) Replace with Si7463DP
- 2920L200/24DR
- Battery 1
- To Lid Pwr Jack and switch
- Battery 2
- NEED HOOKS TO BBB FOR STATUS
- http://cds.linear.com/docs/en/datasheet/4417f.pdf
- Title
- Size:
- Date:
- Orcad A
- Number:
- Time:
- Revision:
- Sheet
- of
- ZLS Corporation
- 7801 North Lamar Blvd.
- Suite E-184
- Austin, Texas 78752  USA
- (512) 453-0288
- File:
- (in symbol CMP-1058-00598-1) 1, 2, 5, 6

### Library data of the parts
C17-C19 = CMP-1037-04913-1: Manufacturer: Taiyo Yuden; Manufacturer Part Number: JMK316BJ106ML-T; Tolerance: ±20%; Notification: Current market demand for these product types have resulted in fluctuating and extending lead times. Lead times may differ.; Supplier 1: Digi-Key; Supplier Part Number 1: 587-5447-1-ND; RoHS: RoHS Compliant; Category: Capacitors; Stock 1: 5600; Pricing 1: 1=0.24, 10=0.161, 100=0.0817, 500=0.05592, 1000=0.04946 (USD); Packaging: Cut Tape (CT); Part Status: Active; Voltage - Rated: 6.3V; Temperature Coefficient: X5R; Operating Temperature: -55°C ~ 85°C; Features: -; Ratings: -; Applications: SMPS Filtering; Failure Rate: -; Mounting Type: Surface Mount, MLCC; Package / Case: 1206 (3216 Metric); Size / Dimension: 0.126" L x 0.063" W (3.20mm x 1.60mm); Height - Seated (Max): -; Thickness (Max): 0.071" (1.80mm); Lead Spacing: -; Lead Style: -; ComponentLink1URL: http://ds.yuden.co.jp/TYCOMPAS/ut/detail.do?productNo=JMK316BJ106ML-T&fileName=JMK316BJ106ML-T_SS&mode=specSheetDownload; ComponentLink1Description: http://ds.yuden.co.jp/TYCOMPAS/ut/detail.do?productNo=JMK316BJ106ML-T&fileName=JMK316BJ106ML-T_SS&mode=specSheetDownload
D1 = D Schottky: DIODE SCHOTTKY 40V 5A DO214AB; Manufacturer: Comchip Technology; Speed: Fast Recovery =< 500ns, > 200mA (Io); Capacitance @ Vr, F: 380pF @ 4V, 1MHz; Supplier 1: Digi-Key; Supplier Part Number 1: 641-1707-6-ND; Manufacturer Part Number: CDBA540-HF; RoHS: RoHS Compliant; Category: Discrete Semiconductor Products; Stock 1: 7367; Pricing 1: 1=0.49, 10=0.381, 25=0.3208, 100=0.2612, 250=0.2164, 500=0.1791, 1000=0.13432, 2500=0.12313 (USD); Packaging: Digi-Reel®; Part Status: Active; Diode Type: Schottky; Current - Average Rectified (Io): 5A; Mounting Type: Surface Mount; Package / Case: DO-214AC, SMA; Supplier Device Package: DO-214AC (SMA); Operating Temperature - Junction: -50°C ~ 150°C; ComponentLink1URL: http://www.comchiptech.com/cms/UserFiles/CDBA540-HF%20Thru505315.%20CDBA5200-HF%20RevC.pdf; ComponentLink1Description: http://www.comchiptech.com/cms/UserFiles/CDBA540-HF%20Thru505315.%20CDBA5200-HF%20RevC.pdf
P3 = IPL1-104-01-L-S-RA-K: Manufacturer: Samtec Inc.; Connector Type: Header; Pitch - Mating: 0.100" (2.54mm); Number of Positions: 4; Number of Positions Loaded: All; Style: Board to Cable/Wire; Shrouding: Shrouded - 4 Wall; Contact Length - Mating: 0.215" (5.46mm); Contact Length - Post: 0.085" (2.16mm); Material Flammability Rating: UL94 V-0; Voltage Rating: 675VAC, 954VDC; Supplier 1: Digi-Key; Supplier Part Number 1: SAM9597-ND; Manufacturer Part Number: IPL1-104-01-L-S-RA-K; RoHS: RoHS Compliant; Category: Connectors, Interconnects; Stock 1: 265; Pricing 1: 1=2.53, 10=2.424, 100=2.02, 500=1.717, 1000=1.4645, 5000=1.313 (USD); Packaging: Tube; Part Status: Active; Contact Type: Male Pin; Number of Rows: 1; Row Spacing - Mating: -; Mounting Type: Through Hole, Right Angle; Termination: Solder; Fastening Type: Locking Ramp; Overall Contact Length: -; Insulation Height: 0.240" (6.10mm); Contact Shape: Square; Contact Finish - Mating: Gold; Contact Finish Thickness - Mating: 10µin (0.25µm); Contact Finish - Post: Tin; Contact Material: Phosphor Bronze; Insulation Material: Liquid Crystal Polymer (LCP); Features: -; Operating Temperature: -55°C ~ 125°C; Ingress Protection: -; Insulation Color: Natural; Current Rating: -; Mated Stacking Heights: -; Contact Finish Thickness - Post: -; Applications: -; ComponentLink1URL: http://suddendocs.samtec.com/prints/ipl1-1xx-xx-xxx-s-xx-x-xx-mkt.pdf; ComponentLink1Description: http://suddendocs.samtec.com/prints/ipl1-1xx-xx-xxx-s-xx-x-xx-mkt.pdf
Q1 Q2 = CMP-1058-00598-1: P-Channel Power MOSFET, -12 V, -5 A, 43 mOhm, Single, 6-Pin MCPH, Pb-Free, Tape and Reel; Manufacturer: On Semiconductor; Channel Polarity: P Channel; VGS(th) Max (V): 1.4; Ciss Typ (pF): 660; V(BR)DSS Min (V): 12; VGS Max (V): 10; Crss Typ (pF): 155; Coss Typ (pF): 210; PD Max (W): 1.5; ID Max (A): 5; Package Type: SC-88FL / MCPH-6; ComponentLink2URL: http://www.onsemi.cn/pub_link/Collateral/MCH6336-D.PDF; ComponentLink3URL: http://www.onsemi.com/pub_link/Collateral/ENA1601-D.PDF; RoHS: Pb-Free; Mounting Technology: Surface Mount; PartNumber: MCH6336-TL-E; ComponentLink2Description: Datasheet; ComponentLink1URL: http://www.onsemi.com/; ComponentLink1Description: Manufacturer URL; Configuration: Single; ComponentLink3Description: Package Specification; Packing: Tape and Reel; PackageDescription: 6-Pin Small Outline Transistor, Body 2 x 1.6 mm, Pitch 0.65 mm; PackageReference: MCPH-6
R7 R8 = CMP-1011-00927-1: Tolerance: ±1%; Temperature Coefficient: ±100ppm/°C; Supplier Part Number 1: YAG3220CT-ND; Supplier Device Package: 0402
U6 U7 = CMP-0479-00214-1: Low Loss PowerPath Controller for Large PFET, 3 to 36 V Vin, 8-pin SOP (MS8-8), -40 to 85 degC, Pb-Free, Tape and Reel; Manufacturer: Linear Technology; Ideal Diode: Single, External, P-Channel; ComponentLink3URL: http://cds.linear.com/docs/en/packaging/05081660_G_MS8.pdf; DatasheetVersion: Rev. C; ComponentLink2Description: Datasheet; ComponentLink1Description: Manufacturer URL; ComponentLink2URL: http://cds.linear.com/docs/en/datasheet/4414fc.pdf; ComponentLink3Description: Package Specification; ComponentLink1URL: http://www.linear.com/; Packing: Tape and Reel; Mounting Technology: Surface Mount; PackageDescription: 8-Pin Plastic MSOP, Body 3 x 3 mm, Pitch 0.65 mm; PackageVersion: Rev. G, 03/2012; PackageReference: MS8-8; PartNumber: LTC4414EMS8#TRPBF; RoHS: TRUE

## Sheet BBB-Supply.SchDoc
size Tabloid
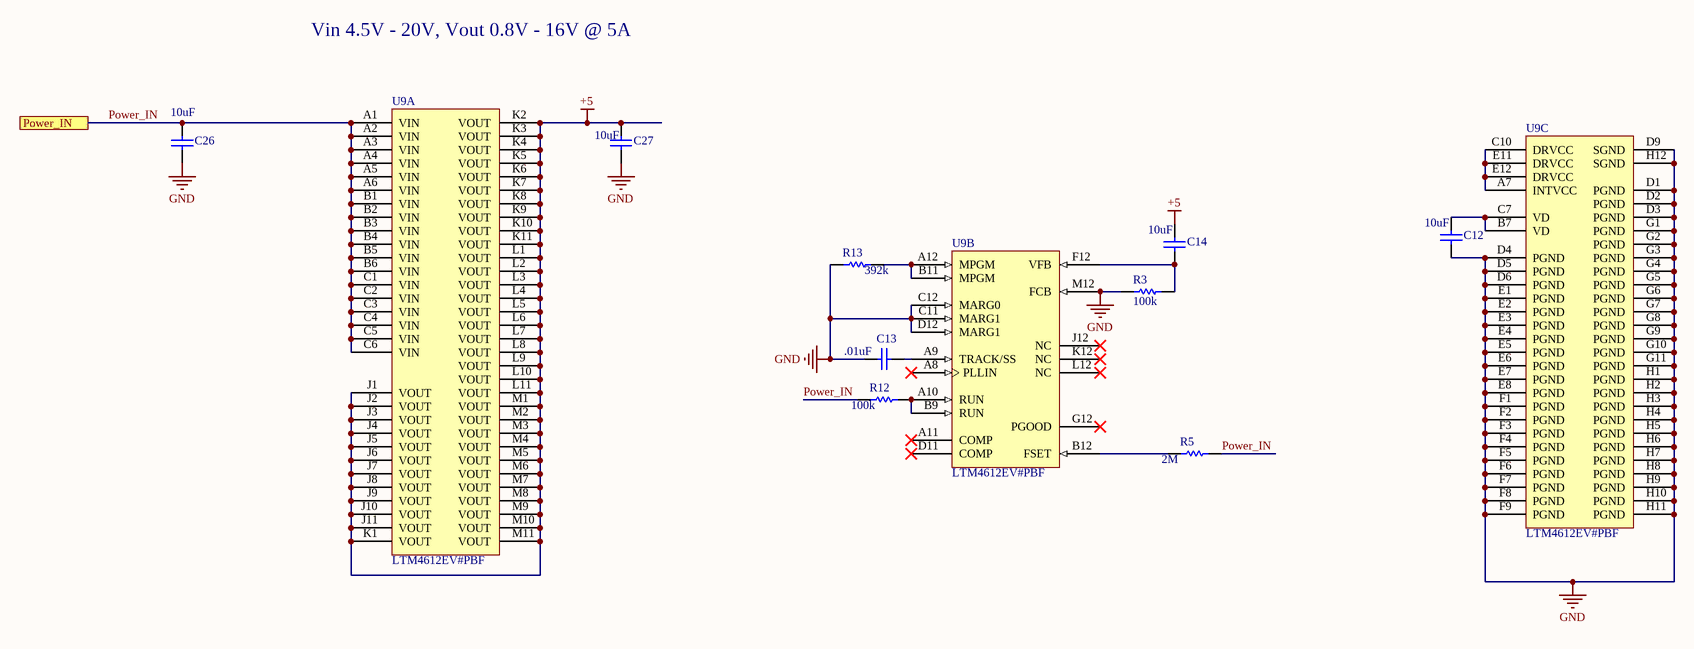
[diagram p3: BBB-Supply.SchDoc]

### Parts
C12  10uF  [CAPC0805(2012)145_N]
C13  .01uF  [CAPC0805(2012)145_N]
C14  10uF  [CAPC0805(2012)145_N]
C26  10uF  [CAPC0805(2012)145_N]
C27  10uF  [CAPC0805(2012)145_N]
R3  100k  [RESC0805(2012)_M]
R5  2M  [RESC0805(2012)_M]
R12  100k  [RESC0805(2012)_M]
R13  392k  [RESC0805(2012)_M]
U9  LTM4612EV#PBF  [LT-LGA-133-05-08-1766_V]  (parts A,B,C of 3)

### Ports
Power_IN

### Nets
+5: C14.1 C27.1 U9.J1(VOUT) U9.J2(VOUT) U9.J3(VOUT) U9.J4(VOUT) U9.J5(VOUT) U9.J6(VOUT) U9.J7(VOUT) U9.J8(VOUT) U9.J9(VOUT) U9.J10(VOUT) U9.J11(VOUT) U9.K1(VOUT) U9.K2(VOUT) U9.K3(VOUT) U9.K4(VOUT) U9.K5(VOUT) U9.K6(VOUT) U9.K7(VOUT) U9.K8(VOUT) U9.K9(VOUT) U9.K10(VOUT) U9.K11(VOUT) U9.L1(VOUT) U9.L2(VOUT) U9.L3(VOUT) U9.L4(VOUT) U9.L5(VOUT) U9.L6(VOUT) U9.L7(VOUT) U9.L8(VOUT) U9.L9(VOUT) U9.L10(VOUT) U9.L11(VOUT) U9.M1(VOUT) U9.M2(VOUT) U9.M3(VOUT) U9.M4(VOUT) U9.M5(VOUT) U9.M6(VOUT) U9.M7(VOUT) U9.M8(VOUT) U9.M9(VOUT) U9.M10(VOUT) U9.M11(VOUT)
GND: C12.2 C13.1 C26.2 C27.2 R3.1 R13.2 U9.C11(MARG1) U9.C12(MARG0) U9.D1(PGND) U9.D2(PGND) U9.D3(PGND) U9.D4(PGND) U9.D5(PGND) U9.D6(PGND) U9.D9(SGND) U9.D12(MARG1) U9.E1(PGND) U9.E2(PGND) U9.E3(PGND) U9.E4(PGND) U9.E5(PGND) U9.E6(PGND) U9.E7(PGND) U9.E8(PGND) U9.F1(PGND) U9.F2(PGND) U9.F3(PGND) U9.F4(PGND) U9.F5(PGND) U9.F6(PGND) U9.F7(PGND) U9.F8(PGND) U9.F9(PGND) U9.G1(PGND) U9.G2(PGND) U9.G3(PGND) U9.G4(PGND) U9.G5(PGND) U9.G6(PGND) U9.G7(PGND) U9.G8(PGND) U9.G9(PGND) U9.G10(PGND) U9.G11(PGND) U9.H1(PGND) U9.H2(PGND) U9.H3(PGND) U9.H4(PGND) U9.H5(PGND) U9.H6(PGND) U9.H7(PGND) U9.H8(PGND) U9.H9(PGND) U9.H10(PGND) U9.H11(PGND) U9.H12(SGND) U9.M12(FCB)
Power_IN: C26.1 R5.1 R12.2 U9.A1(VIN) U9.A2(VIN) U9.A3(VIN) U9.A4(VIN) U9.A5(VIN) U9.A6(VIN) U9.B1(VIN) U9.B2(VIN) U9.B3(VIN) U9.B4(VIN) U9.B5(VIN) U9.B6(VIN) U9.C1(VIN) U9.C2(VIN) U9.C3(VIN) U9.C4(VIN) U9.C5(VIN) U9.C6(VIN) ; port Power_IN
NetC12_1: C12.1 U9.B7(VD) U9.C7(VD)
NetC13_2: C13.2 U9.A9(TRACK/SS)
NetC14_2: C14.2 R3.2 U9.F12(VFB)
NetR5_2: R5.2 U9.B12(FSET)
NetR12_1: R12.1 U9.A10(RUN) U9.B9(RUN)
NetR13_1: R13.1 U9.A12(MPGM) U9.B11(MPGM)
NetU9_A7: U9.A7(INTVCC) U9.C10(DRVCC) U9.E11(DRVCC) U9.E12(DRVCC)

Not connected (* = marked no-connect by the designer): U9 A8(PLLIN)* A11(COMP)* D11(COMP)* G12(PGOOD)* J12(NC)* K12(NC)* L12(NC)*

### Notes on the sheet
- Vin 4.5V - 20V, Vout 0.8V - 16V @ 5A
- Title
- Size:
- Date:
- Tabloid
- Number:
- Time:
- Revision:
- Sheet
- of
- ZLS Corporation
- 7801 North Lamar Blvd.
- Suite E-184
- Austin, Texas 78752  USA
- (512) 453-0288
- File:

### Library data of the parts
C12 C14 C26 C27 = CMP-1036-04795-1: CAP CER 10UF 25V X7R 0805; Manufacturer: TDK; Manufacturer Part Number: C2012X5R1V106K125AC; Tolerance: 10 %; Type: Commercial Grade MLCC; Voltage Rating DC: 35 VDC; Class: Class 2; Dielectric: X5R; Supplier 1: Mouser; Supplier Part Number 1: 810-C2012X5R1V106K1C; RoHS: RoHS Compliant; Category: Multilayer Ceramic Capacitors MLCC - SMD/SMT; Stock 1: 33130; Pricing 1: 1=0.920, 10=0.648, 100=0.426, 500=0.316, 1000=0.268, 2000=0.220 (USD); Capacitance: 10 uF; Height: 1.25 mm; Length: 2 mm; Package / Case: 0805 (2012 metric); Packaging: Cut Tape; Product: General Type MLCCs; Series: C; Termination Style: SMD/SMT; Width: 1.25 mm; Brand: TDK; Case Code - in: 0805; Case Code - mm: 2012; Maximum Operating Temperature: + 85 C; Minimum Operating Temperature: - 55 C; Product Type: Ceramic Capacitors; Standard Pack Qty: 2000; Subcategory: Capacitors; RoHS - Mouser: Y; Minimum Order Quantity: 1; Reeling: True; ComponentLink1URL: https://www.mouser.com/datasheet/2/400/lcc_commercial_general_en-837201.pdf; ComponentLink1Description: https://www.mouser.com/datasheet/2/400/lcc_commercial_general_en-837201.pdf
C13 = CMP-1036-04795-1: Manufacturer: Yageo; Manufacturer Part Number: AC0805KRX7R7BB103; Tolerance: ±10%; Voltage - Rated: 16V; Temperature Coefficient: X7R; Supplier 1: Digi-Key; Supplier Part Number 1: 311-3161-6-ND; RoHS: RoHS Compliant; Category: Capacitors; Stock 1: 311; Pricing 1: 1=0.22, 10=0.158, 100=0.0745, 500=0.05224, 1000=0.04324 (USD); Packaging: Digi-Reel®; Part Status: Active; Operating Temperature: -55°C ~ 125°C; Features: -; Ratings: AEC-Q200; Applications: Automotive; Failure Rate: -; Mounting Type: Surface Mount, MLCC; Package / Case: 0805 (2012 Metric); Size / Dimension: 0.079" L x 0.049" W (2.00mm x 1.25mm); Height - Seated (Max): -; Thickness (Max): 0.037" (0.95mm); Lead Spacing: -; Lead Style: -; ComponentLink1URL: http://www.yageo.com/NewPortal/_en/search/productDocs.jsp?YageoPartNumber=AC0805KRX7R7BB103; ComponentLink1Description: http://www.yageo.com/NewPortal/_en/search/productDocs.jsp?YageoPartNumber=AC0805KRX7R7BB103
R3 R5 R12 R13 = CMP-1013-00017-1: RES SMD 0.8 OHM 1% 1/8W 0805; ComponentLink1URL: https://www.mouser.com/datasheet/2/219/TLRH-2321.pdf; ComponentLink1Description: https://www.mouser.com/datasheet/2/219/TLRH-2321.pdf
U9 = CMP-0483-00080-1: EN55022B Compliant 36 VIN, 15 VOUT, 5 A, DC/DC uModule Regulator, 133-pin LGA, -40 to 125 degC, Pb-Free, Tray; Manufacturer: Linear Technology; Isupply(mA): 4.5; Tracking: yes; Frequency(kHz): 940; Frequency Sync Range: 200kHz - 1.3MHz; Vin Min(V): 5; Switch Current(A): 9; Vout Min(V): 3.3; Vout Max(V): 15; Number of Outputs: 1; Extended Temp: E, I, MP; Vin Max(V): 36; Ishutdown(uA): 50; Topology: Buck; Packing: Tray; PackageReference: LGA-133; ComponentLink3URL: http://cds.linear.com/docs/en/packaging/05081766_A_lga133.pdf; Code_JEDEC: MO-222; DatasheetVersion: Rev. B; PartNumber: LTM4612EV#PBF; Synchronous: yes; RoHS: TRUE; Mounting Technology: Surface Mount; ComponentLink1URL: http://www.linear.com/; ComponentLink2URL: http://cds.linear.com/docs/en/datasheet/4612fb.pdf; ComponentLink1Description: Manufacturer URL; PackageDescription: 133-Pin LGA, Body 15 x 15 mm, Pitch 1.27 mm; ComponentLink3Description: Package Specification; PackageVersion: Rev. A, 02/2013; ComponentLink2Description: Datasheet; Output Current(A): 5; PartId: 1

## Sheet 36V_HV_Supply.SchDoc
size Tabloid; Organization: Altium Limited; Address1: L3, 12a Rodborough Rd; Address2: Frenchs Forest; Address3: NSW; Address4: Australia 2086
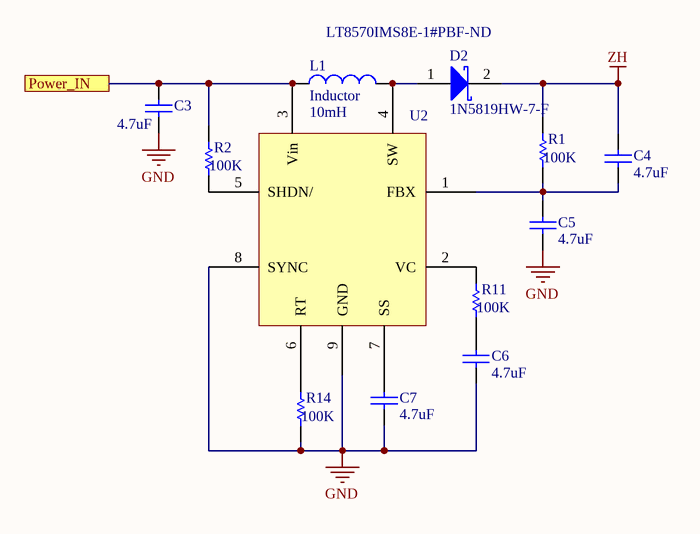
[diagram p4: 36V_HV_Supply.SchDoc]

### Parts
C3  4.7uF  [CAPC1210(3225)100_M]
C4  4.7uF  [CAPC1210(3225)100_M]
C5  4.7uF  [CAPC1210(3225)100_M]
C6  4.7uF  [CAPC1210(3225)100_M]
C7  4.7uF  [CAPC1210(3225)100_M]
D2  1N5819HW-7-F  [DIOD-SOD-123-2_V]
L1  Inductor  value 10mH  [0402-A]
R1  Resistance: 100K  [RESC0805(2012)_M]  (hidden comment: RES SMD 100K OHM 1% 1/8W 0805)
R2  Resistance: 100K  [RESC0805(2012)_M]  (hidden comment: RES SMD 100K OHM 1% 1/8W 0805)
R11  Resistance: 100K  [RESC0805(2012)_M]  (hidden comment: RES SMD 100K OHM 1% 1/8W 0805)
R14  Resistance: 100K  [RESC0805(2012)_M]  (hidden comment: RES SMD 100K OHM 1% 1/8W 0805)
U2  Supplier Part Number 1: LT8570IMS8E-1#PBF-ND  [LT8570-MSOP]  (hidden comment: LT8570)

### Ports
Power_IN

### Nets
GND: C3.1 C5.1 C6.1 C7.1 R14.2 U2.8(SYNC) U2.9(GND)
ZH: C4.2 D2.2(K) R1.1
Power_IN: C3.2 L1.1 R2.1 U2.3(Vin) ; port Power_IN
NetC4_1: C4.1 C5.2 R1.2 U2.1(FBX)
NetC6_2: C6.2 R11.2
NetC7_2: C7.2 U2.7(SS)
NetD2_1: D2.1(A) L1.2 U2.4(SW)
NetR2_2: R2.2 U2.5(SHDN/)
NetR11_1: R11.1 U2.2(VC)
NetR14_1: R14.1 U2.6(RT)

### Notes on the sheet
- Title
- Size:
- Date:
- Tabloid
- Number:
- Time:
- Revision:
- Sheet
- of
- File:

### Library data of the parts
C3-C7 = CMP-1038-00619-1: as C21 on sheet 12_Supply; Supplier 1: Digi-Key; Supplier Part Number 1: 490-8066-6-ND; Stock 1: 63504; Pricing 1: 1=1.8, 10=1.424, 100=1.0676, 500=0.80666, 1000=0.71177 (USD); Mount: Surface Mount; Case/Package: 1210; Case Code (Metric): 3225; Case Code (Imperial): 1210; Min Operating Temperature: -55°C; Max Operating Temperature: 125°C; Capacitance: 4.7uF; Packaging: Tape and Reel; Package Quantity: 1; Voltage Rating: 50V; Voltage Rating (DC): 50V; Dielectric: X7R; Termination: SMD/SMT; Length: 3.2mm; Height: 2.5mm; Width: 0.098inch; Thickness: 0.106inch; Depth: 2.5mm; Ratings: AEC-Q200; Radiation Hardening: No; ComponentLink1URL: http://search.murata.co.jp/Ceramy/image/img/A01X/partnumbering_e_02.pdf?src-supplier=Digi-Key; ComponentLink1Description: http://search.murata.co.jp/Ceramy/image/img/A01X/partnumbering_e_02.pdf?src-supplier=Digi-Key; ComponentLink2URL: http://psearch.en.murata.com/capacitor/product/GCM32ER71H475KA55%23.pdf?src-supplier=Digi-Key; ComponentLink2Description: http://psearch.en.murata.com/capacitor/product/GCM32ER71H475KA55%23.pdf?src-supplier=Digi-Key; ComponentLink3URL: http://psearch.murata.com/capacitor/product/GCM32ER71H475KA55%23.pdf?src-supplier=Avnet; ComponentLink3Description: http://psearch.murata.com/capacitor/product/GCM32ER71H475KA55%23.pdf?src-supplier=Avnet
D2 = CMP-0303-00003-1: 1.0 A Surface Mount Schottky Barrier Rectifier, 40 V, -65 to 125 degC, 2-Pin SOD-123 Package, RoHS, Tape and Reel; Manufacturer: Diodes Inc; @ VR (V): 40; @ Terminal Temperature TT (degC): 90; Maximum Average Rectified Current IO (A): 1; Total Capacitance CT (pF): 50; Peak Forward Surge Current IFSM (A): 25; Forward Voltage Drop VF (V): 0.45; VR (RMS) (V): 28; RoHS: TRUE; PartNumber: 1N5819HW-7-F; ComponentLink2URL: http://www.diodes.com/datasheets/ds30217.pdf; PackageDescription: 2-Pin SOD-123, Body 2.7 x 1.55 mm, Pitch 3.7 mm; @ IF (A): 1; Operating and Storage Temperature Range: -65 to 125 degC; ComponentLink1Description: Manufacturer URL; ComponentLink2Description: Datasheet; ComponentLink1URL: http://www.diodes.com/; Mounting Technology: Surface Mount; DatasheetVersion: Rev. 15-2; PackageReference: SOD-123-2; Maximum Reverse Current IR (uA): 50; Peak Repetitive Reverse Voltage VRRM (V): 40; Packing: Tape and Reel
L1 = Inductor: Code_IEC: 1005; Published: 8-Jun-2000; LatestRevisionDate: 29-May-2009; LatestRevisionNote: IPC-7351 Footprint Added.; PackageReference: 0402-A; Publisher: Altium Limited; PackageDescription: Chip Inductor; Code_JEITA: 0402
R1 R2 R11 R14 = CMP-1013-00017-1: as R4 on sheet 12_Supply; Supplier 1: Avnet; Supplier Part Number 1: CRCW0805100KFKEA/BKN; Stock 1: 1317; Pricing 1: 1=0.1, 10=0.049, 25=0.042, 50=0.035, 100=0.028 (USD); Mount: Surface Mount; Case/Package: 0805; Number of Pins: 2; Weight: 0.000194oz; Contact Plating: Tin; Case Code (Imperial): 0805; Case Code (Metric): 2012; Min Operating Temperature: -55°C; Max Operating Temperature: 155°C; Tolerance: 1%; Composition: Thick Film; Termination: SMD/SMT; Packaging: Tape and Reel; Package Quantity: 5000; Military Standard: Not; Voltage Rating (DC): 150V; Length: 2mm; Height: 0.45mm; Width: 1.25mm; Depth: 1.25mm; Radiation Hardening: No; Lead Free: Lead Free; REACH SVHC: Unknown; ComponentLink1URL: https://datasheet.ciiva.com/11809/0900766b80d98b26-11809057.pdf; ComponentLink1Description: https://datasheet.ciiva.com/11809/0900766b80d98b26-11809057.pdf; ComponentLink2URL: https://datasheet.ciiva.com/7777/1697337-7777349.pdf; ComponentLink2Description: https://datasheet.ciiva.com/7777/1697337-7777349.pdf; ComponentLink3URL: https://datasheet.ciiva.com/3258/dcrcwe3-3258006.pdf; ComponentLink3Description: https://datasheet.ciiva.com/3258/dcrcwe3-3258006.pdf; ComponentLink4URL: https://datasheet.ciiva.com/16754/70201119-16754822.pdf; ComponentLink4Description: https://datasheet.ciiva.com/16754/70201119-16754822.pdf; ComponentLink5URL: https://datasheet.ciiva.com/8337/dcrcwe3-8337738.pdf; ComponentLink5Description: https://datasheet.ciiva.com/8337/dcrcwe3-8337738.pdf; ComponentLink6URL: https://datasheet.ciiva.com/16341/dcrcwe3-16341530.pdf; ComponentLink6Description: https://datasheet.ciiva.com/16341/dcrcwe3-16341530.pdf; ComponentLink7URL: https://datasheet.ciiva.com/16852/dcrcwe3-16852810.pdf; ComponentLink7Description: https://datasheet.ciiva.com/16852/dcrcwe3-16852810.pdf; ComponentLink8URL: https://datasheet.ciiva.com/16720/70201119-16720891.pdf; ComponentLink8Description: https://datasheet.ciiva.com/16720/70201119-16720891.pdf; ComponentLink9URL: https://datasheet.ciiva.com/7777/1720486-7777565.pdf; ComponentLink9Description: https://datasheet.ciiva.com/7777/1720486-7777565.pdf
U2 = LT8570: Supplier 1: Digi-Key

## Nets that join several sheets
+3.3: LM-008 (C1.2 P1.26 P2.5 U1.5), Force_Plate_Power_Supply (R7.2 R8.2)
+5: LM-008 (8 pins), 12_Supply (U5.5), BBB-Supply (46 pins)
+12: LM-008 (P1.29 P1.30 P2.13), 12_Supply (22 pins)
Battery_1: LM-008 (P2.11), Force_Plate_Power_Supply (7 pins)
Battery_2: LM-008 (P2.15), Force_Plate_Power_Supply (7 pins)
GND: LM-008 (17 pins), 12_Supply (85 pins), Force_Plate_Power_Supply (11 pins), BBB-Supply (57 pins), 36V_HV_Supply (7 pins)
Batt_1_Stat: LM-008 (P2.8), Force_Plate_Power_Supply (R7.1 U6.1)
Batt_2_Stat: LM-008 (P2.10), Force_Plate_Power_Supply (R8.1 U7.1)
BBB_PWR_SW: LM-008 (P1.4), Force_Plate_Power_Supply (P3.2)
Power_IN: 12_Supply (14 pins), Force_Plate_Power_Supply (6 pins), BBB-Supply (21 pins), 36V_HV_Supply (C3.2 L1.1 R2.1 U2.3)
Sys_Pwr_Enable: LM-008 (P2.14), 12_Supply (U5.3)